# Altium project PCB_My_BOOST.PrjPcb
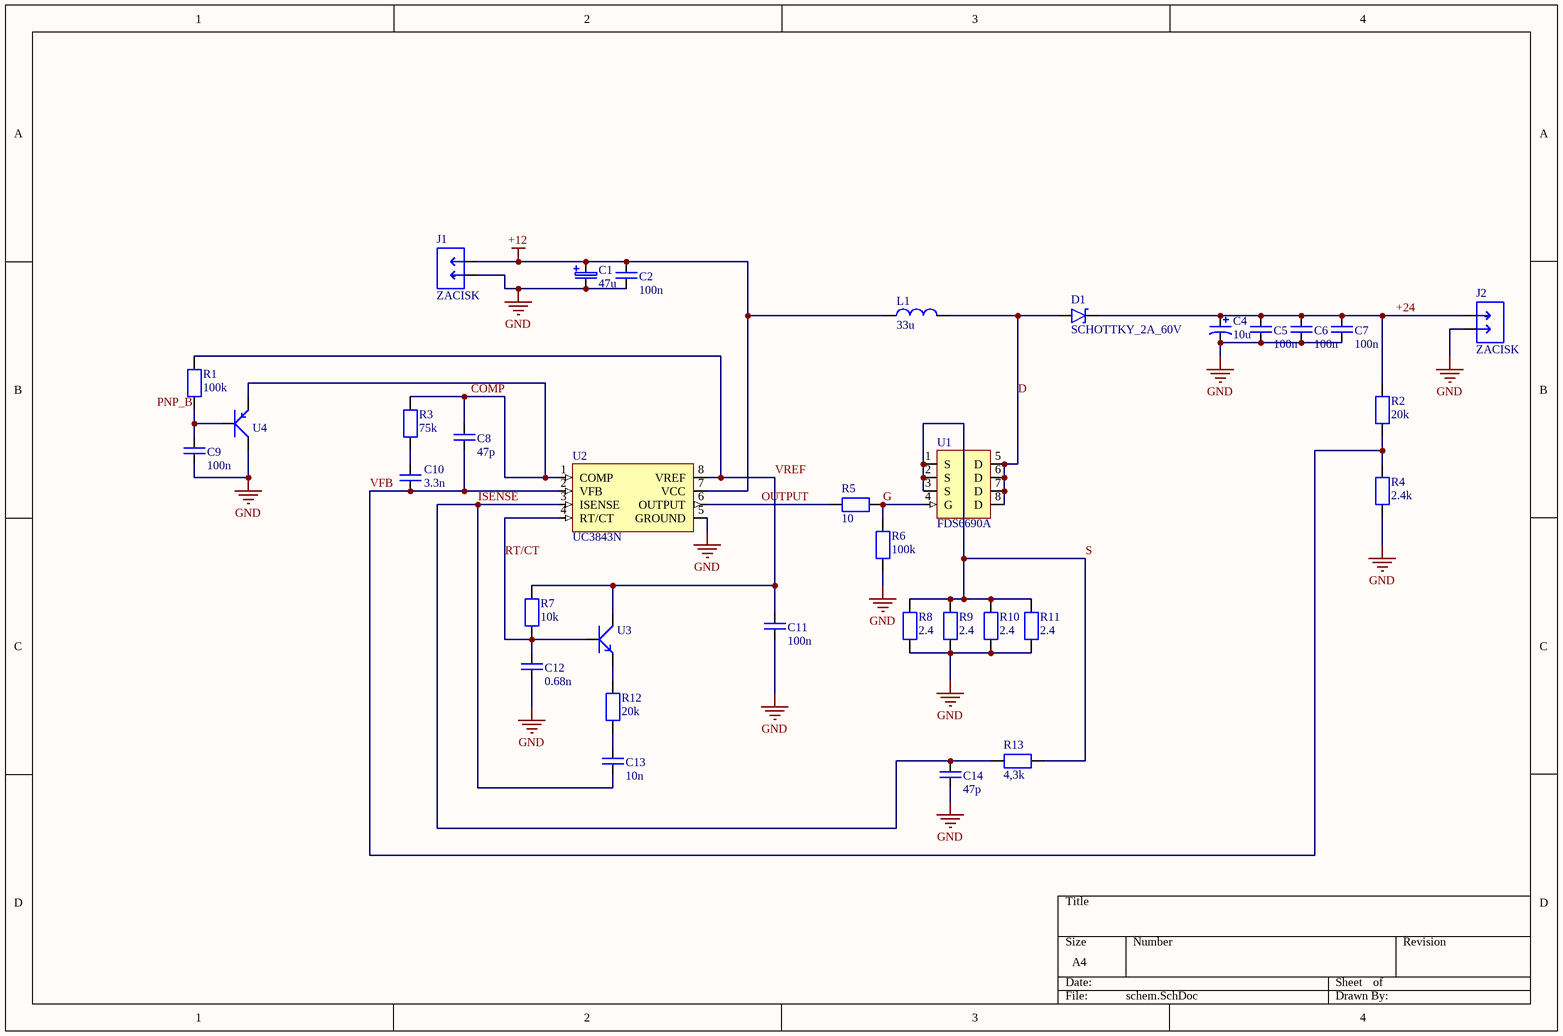
[diagram p0: schem.SchDoc]
1 sheet, 34 parts. Net scope: global (net labels, ports and power ports of the same name join across sheets).
Board files: PCB.PcbDoc, PCB_kopia.PcbDoc

## Sheet schem.SchDoc
size A4; SheetNumber: 1; SheetTotal: 1

### Parts
C1  47u  [CAP_ALUM]
C2  100n  [CAP_0805_CER]
C4  10u  [CAP_TANTAL_1210]
C5  100n  [CAP_0805_CER]
C6  100n  [CAP_0805_CER]
C7  100n  [CAP_0805_CER]
C8  47p  [CAP_0805_CER]
C9  100n  [CAP_0805_CER]
C10  3.3n  [CAP_0805_CER]
C11  100n  [CAP_0805_CER]
C12  0.68n  [CAP_0805_CER]
C13  10n  [CAP_0805_CER]
C14  47p  [CAP_0805_CER]
D1  SCHOTTKY_2A_60V  [23SCHOTTKY_60V_2A]
J1  ZACISK  [Zacisk]
J2  ZACISK  [Zacisk]
L1  33u  [DL50-33]
R1  100k  [RES_0805]
R2  20k  [RES_0805]
R3  75k  [RES_0805]
R4  2.4k  [RES_0805]
R5  10  [RES_0805]
R6  100k  [RES_0805]
R7  10k  [RES_0805]
R8  2.4  [RES_1206]
R9  2.4  [RES_1206]
R10  2.4  [RES_1206]
R11  2.4  [RES_1206]
R12  20k  [RES_0805]
R13  4,3k  [RES_0805]
U1  FDS6690A  [FDS6690A]
U2  UC3843N  [UC3843N]
U3  NPN_MMBT3904LT1G  [NPN]  (value not drawn)
U4  PNP_BC807-25LT1G  [PNP]  (value not drawn)

### Nets
+12: C1.2 C2.2 J1.1(+) L1.1 U2.7(VCC)
GND: C1.1 C2.1 C4.1 C5.1 C6.1 C7.1 C9.1 C11.1 C12.2 C14.1 J1.2(-) J2.1(+) R4.1 R6.1 R8.1 R9.1 R10.1 R11.1 U2.5(GROUND) U4.3
+24: C4.2 C5.2 C6.2 C7.2 D1.1 J2.2(-) R2.2
COMP: C8.2 R3.1 U2.1(COMP) U4.2
D: D1.2 L1.2 U1.5(D) U1.6(D) U1.7(D) U1.8(D)
G: R5.2 R6.2 U1.4(G)
ISENSE: C13.1 C14.2 R13.1 U2.3(ISENSE)
OUTPUT: R5.1 U2.6(OUTPUT)
PNP_B: C9.2 R1.1 U4.1
RT/CT: C12.1 R7.1 U2.4(RT/CT) U3.1
S: R8.2 R9.2 R10.2 R11.2 R13.2 U1.1(S) U1.2(S) U1.3(S)
VFB: C8.1 C10.2 R2.1 R4.2 U2.2(VFB)
VREF: C11.2 R1.2 R7.2 U2.8(VREF) U3.3
NetC10_1: C10.1 R3.2
NetC13_2: C13.2 R12.1
NetR12_2: R12.2 U3.2

### Library data of the parts
C1 = CAP_47uF_16V_ALUM: Kondensator: elektrolityczny; SMD; 47uF; 16VDC; Ø5x5,3mm; ±20%; Manufacturer Lifecycle Status: ACTIVE; Part Series: FK; Manufacturer: Panasonic; Value: 100µF; Dielectric Material: Aluminium; Dissipation Factor: 8%; ESR (Equivalent Series Resistance): 350mΩ; Leakage Current: 63µA; Life (Hours): 2000hours; Polarity: Polar; Ripple Current: 400mA; Voltage: 63V; Supplier: RS; Supplier Part Number: 7083623P; RoHS: Compliant; Stock: 1435; Case/Package: Radial; Contact Plating: Tin; Country of Origin: Japan, Malaysia; Diameter: 10mm; Export Control Classification Number (ECCN) Code: EAR99; Height: 10.2mm; Height - Seated (Max): 10.4902mm; Harmonized Tariff Schedule (HTS) Code: 8532.22.00.20; Impedance: 350mΩ; Introduction Date: 2004-08-25; Lead Free: Lead Free; Lifecycle Status: Production; Material: Aluminium; Max Operating Temperature: 105°C; Min Operating Temperature: -55°C; Mounting Technology: Surface Mount; Pins: 2; Number of Terminals: 2; Packaging: Cut Tape; Radiation Hardening: No; REACH SVHC: Yes; Ripple Current (AC): 400mA; Schedule B: 8532220020, 8532220020|8532220020|8532220020|8532220020|8532220020|8532220020|8532220020|8532220020|8532220020|8532220020|8532220020|8532220020|8532220020|8532220020|8532220020|8532220020|8532220020|8532220020|8532220020|8532220020|8532220020|8532220020|8532220020|85; Termination: SMD/SMT; Tolerance: 20%; Voltage Rating: 63V; Voltage Rating (AC): 63V; Voltage Rating (DC): 63V; Width: 10.3mm; ComponentLink1URL: https://datasheet.octopart.com:443/EEEFK1J101P-Panasonic-datasheet-62287436.pdf?src-supplier=Farnell; ComponentLink1Description: https://datasheet.octopart.com:443/EEEFK1J101P-Panasonic-datasheet-62287436.pdf?src-supplier=Farnell; ComponentLink2URL: https://datasheet.octopart.com:443/EEEFK1J101P-Panasonic-datasheet-5318435.pdf?src-supplier=Farnell; ComponentLink2Description: https://datasheet.octopart.com:443/EEEFK1J101P-Panasonic-datasheet-5318435.pdf?src-supplier=Farnell; ComponentLink3URL: https://datasheet.octopart.com:443/EEEFK1J101P-Panasonic-datasheet-5316599.pdf?src-supplier=Farnell; ComponentLink3Description: https://datasheet.octopart.com:443/EEEFK1J101P-Panasonic-datasheet-5316599.pdf?src-supplier=Farnell; ComponentLink4URL: https://datasheet.octopart.com:443/EEEFK1J101P-Panasonic-datasheet-5390910.pdf?src-supplier=Farnell; ComponentLink4Description: https://datasheet.octopart.com:443/EEEFK1J101P-Panasonic-datasheet-5390910.pdf?src-supplier=Farnell; ComponentLink5URL: https://datasheet.octopart.com:443/EEEFK1J101P-Panasonic-datasheet-7550061.pdf?src-supplier=Farnell; ComponentLink5Description: https://datasheet.octopart.com:443/EEEFK1J101P-Panasonic-datasheet-7550061.pdf?src-supplier=Farnell; ComponentLink6URL: https://datasheet.octopart.com:443/EEEFK1J101P-Panasonic-datasheet-1770.pdf?src-supplier=Farnell; ComponentLink6Description: https://datasheet.octopart.com:443/EEEFK1J101P-Panasonic-datasheet-1770.pdf?src-supplier=Farnell; ComponentLink7URL: https://datasheet.octopart.com:443/EEEFK1J101P-Panasonic-datasheet-1290.pdf?src-supplier=Farnell; ComponentLink7Description: https://datasheet.octopart.com:443/EEEFK1J101P-Panasonic-datasheet-1290.pdf?src-supplier=Farnell; ComponentLink8URL: https://datasheet.octopart.com:443/EEEFK1J101P-Panasonic-datasheet-2601.pdf?src-supplier=Farnell; ComponentLink8Description: https://datasheet.octopart.com:443/EEEFK1J101P-Panasonic-datasheet-2601.pdf?src-supplier=Farnell; ComponentLink9URL: https://datasheet.octopart.com:443/EEEFK1J101P-Panasonic-datasheet-122249.pdf?src-supplier=Farnell; ComponentLink9Description: https://datasheet.octopart.com:443/EEEFK1J101P-Panasonic-datasheet-122249.pdf?src-supplier=Farnell; ComponentLink10URL: https://datasheet.octopart.com:443/EEEFK1J101P-Panasonic-datasheet-4056.pdf?src-supplier=Farnell; ComponentLink10Description: https://datasheet.octopart.com:443/EEEFK1J101P-Panasonic-datasheet-4056.pdf?src-supplier=Farnell; ComponentLink11URL: https://datasheet.octopart.com:443/EEEFK1J101P-Panasonic-datasheet-169278531.pdf?src-supplier=IHS; ComponentLink11Description: https://datasheet.octopart.com:443/EEEFK1J101P-Panasonic-datasheet-169278531.pdf?src-supplier=IHS; ComponentLink12URL: https://datasheet.octopart.com:443/EEEFK1J101P-Panasonic-datasheet-8161.pdf?src-supplier=Newark; ComponentLink12Description: https://datasheet.octopart.com:443/EEEFK1J101P-Panasonic-datasheet-8161.pdf?src-supplier=Newark; ComponentLink13URL: https://datasheet.octopart.com:443/EEEFK1J101P-Panasonic-datasheet-61627622.pdf?src-supplier=Newark; ComponentLink13Description: https://datasheet.octopart.com:443/EEEFK1J101P-Panasonic-datasheet-61627622.pdf?src-supplier=Newark; ComponentLink14URL: https://datasheet.octopart.com:443/EEEFK1J101P-Panasonic-datasheet-8852369.pdf?src-supplier=Newark; ComponentLink14Description: https://datasheet.octopart.com:443/EEEFK1J101P-Panasonic-datasheet-8852369.pdf?src-supplier=Newark; ComponentLink15URL: https://datasheet.octopart.com:443/EEEFK1J101P-Panasonic-datasheet-8712906.pdf?src-supplier=Newark; ComponentLink15Description: https://datasheet.octopart.com:443/EEEFK1J101P-Panasonic-datasheet-8712906.pdf?src-supplier=Newark; ComponentLink16URL: https://datasheet.octopart.com:443/EEEFK1J101P-Panasonic-datasheet-13278598.pdf?src-supplier=Newark; ComponentLink16Description: https://datasheet.octopart.com:443/EEEFK1J101P-Panasonic-datasheet-13278598.pdf?src-supplier=Newark; ComponentLink17URL: https://datasheet.octopart.com:443/EEE-FK1J101P-Panasonic-datasheet-22087609.pdf?src-supplier=Newark; ComponentLink17Description: https://datasheet.octopart.com:443/EEE-FK1J101P-Panasonic-datasheet-22087609.pdf?src-supplier=Newark; ComponentLink18URL: https://datasheet.octopart.com:443/EEEFK1J101P-Panasonic-datasheet-11546739.pdf?src-supplier=Electro+Sonic; ComponentLink18Description: https://datasheet.octopart.com:443/EEEFK1J101P-Panasonic-datasheet-11546739.pdf?src-supplier=Electro+Sonic; ComponentLink19URL: https://datasheet.octopart.com:443/EEEFK1J101P-Panasonic-datasheet-13266987.pdf?src-supplier=RS+(Formerly+Allied+Electronics); ComponentLink19Description: https://datasheet.octopart.com:443/EEEFK1J101P-Panasonic-datasheet-13266987.pdf?src-supplier=RS+(Formerly+Allied+Electronics); ComponentLink20URL: https://datasheet.octopart.com:443/EEE-FK1J101P-Panasonic-datasheet-150469824.pdf?src-supplier=Master+Electronics; ComponentLink20Description: https://datasheet.octopart.com:443/EEE-FK1J101P-Panasonic-datasheet-150469824.pdf?src-supplier=Master+Electronics; ComponentLink21URL: https://datasheet.octopart.com:443/EEEFK1J101P-Panasonic-datasheet-8854493.pdf?src-supplier=Future+Electronics; ComponentLink21Description: https://datasheet.octopart.com:443/EEEFK1J101P-Panasonic-datasheet-8854493.pdf?src-supplier=Future+Electronics; ComponentLink22URL: https://datasheet.octopart.com:443/EEEFK1J101P-Panasonic-datasheet-8711795.pdf?src-supplier=Future+Electronics; ComponentLink22Description: https://datasheet.octopart.com:443/EEEFK1J101P-Panasonic-datasheet-8711795.pdf?src-supplier=Future+Electronics; ComponentLink23URL: https://datasheet.octopart.com:443/EEEFK1J101P-Panasonic-datasheet-5313801.pdf?src-supplier=Future+Electronics; ComponentLink23Description: https://datasheet.octopart.com:443/EEEFK1J101P-Panasonic-datasheet-5313801.pdf?src-supplier=Future+Electronics; ComponentLink24URL: https://datasheet.octopart.com:443/EEEFK1J101P-Panasonic-datasheet-7555708.pdf?src-supplier=Jameco; ComponentLink24Description: https://datasheet.octopart.com:443/EEEFK1J101P-Panasonic-datasheet-7555708.pdf?src-supplier=Jameco; ComponentLink25URL: https://sigma.octopart.com:443/150570760/technical_drawing/Panasonic-EEEFK1J101P.pdf?src-supplier=Panasonic+SCT; ComponentLink25Description: https://sigma.octopart.com:443/150570760/technical_drawing/Panasonic-EEEFK1J101P.pdf?src-supplier=Panasonic+SCT; ComponentLink26URL: https://datasheet.octopart.com:443/EEEFK1J101P-Panasonic-datasheet-136531309.pdf?src-supplier=TME; ComponentLink26Description: https://datasheet.octopart.com:443/EEEFK1J101P-Panasonic-datasheet-136531309.pdf?src-supplier=TME
C2 C5-C7 C9 C11 = CAP_100nF_ 0805_CER: Kondensator: ceramiczny; MLCC; 100nF; 50V; X7R; ±10%; SMD; 0805
C4 = CAP_10uF_1210_TANTALUM: Kondensator: tantalowo-polimerowy; low ESR; 10uF; 35VDC; B; 1210
C8 C14 = CAP_47pF_ 0805_CER: Kondensator: ceramiczny; MLCC; 47pF; 50V; C0G (NP0); ±5%; SMD; 0805
C10 = CAP_3,3nF_0805_CER: Kondensator: ceramiczny; MLCC; 3,3nF; 200V; C0G (NP0); ±5%; SMD
C12 = CAP_680pF_0805_CER: Kondensator: ceramiczny; MLCC; 680pF; 50V; C0G (NP0); ±5%; SMD; 0805
C13 = CAP_10nF_0805_CER: Kondensator: ceramiczny; MLCC; 10nF; 50V; C0G (NP0); ±5%; SMD; 0805
D1 = SCHOTTKY_2A_60V: Dioda: prostownicza Schottky; SMA; SMD; 60V; 2A; rolka,taśma; Manufacturer: STMicroelectronics; Manufacturer Part Number: STPS2L60A; Element Configuration: Single; Forward Voltage: 550mV; Max Forward Surge Current (Ifsm): 75A; Max Junction Temperature (Tj): 150°C; Max Reverse Leakage Current: 100µA; Number of Elements: 1; Polarity: Standard; Supplier: RS; Supplier Part Number: 249218P; RoHS: Compliant; Category: Schottky Diodes; Stock: 4660; Average Rectified Current: 2A; Case/Package: SMA; China RoHS: Non-Compliant; Contact Plating: Tin; Current Rating: 2A; Forward Current: 2A; Height: 2.65mm; Lead Free: Lead Free; Length: 4.6mm; Lifecycle Status: Production; Max Operating Temperature: 150°C; Max Output current: 2A; Max Repetitive Reverse Voltage (Vrrm): 60V; Max Reverse Voltage (DC): 60V; Max Surge Current: 75A; Min Operating Temperature: -65°C; Mounting Technology: Surface Mount; Pins: 2; Number of Terminals: 2; Output Current: 2A; Packaging: Tape and Reel; Peak Non-Repetitive Surge Current: 75A; Peak Reverse Current: 100µA; Radiation Hardening: No; REACH SVHC: No; Reverse Standoff Voltage: 60V; Schedule B: 8541100080, 8541100080|8541100080|8541100080|8541100080|8541100080, 8541100080|8541100080|8541100080|8541100080|8541100080|8541100080, 8541100080|8541100080|8541100080|8541100080|8541100080|8541100080|8541100080|8541100080|8541100080|8541100080|8541100080|8541100080|8541100080|8541100080|8541100080|8541100080|8541100080|8541100080|8541100080|8541100080|8541100080|8541100080|8541100080|85; Voltage Rating (DC): 60V; Weight: 4.535924g; Width: 2.95mm; ComponentLink1URL: https://datasheet.octopart.com:443/STPS2L60A-STMicroelectronics-datasheet-10540977.pdf?src-supplier=element14+APAC; ComponentLink1Description: https://datasheet.octopart.com:443/STPS2L60A-STMicroelectronics-datasheet-10540977.pdf?src-supplier=element14+APAC; ComponentLink2URL: https://datasheet.octopart.com:443/STPS2L60A-STMicroelectronics-datasheet-62337125.pdf?src-supplier=Newark; ComponentLink2Description: https://datasheet.octopart.com:443/STPS2L60A-STMicroelectronics-datasheet-62337125.pdf?src-supplier=Newark; ComponentLink3URL: https://datasheet.octopart.com:443/STPS2L60A-STMicroelectronics-datasheet-633754.pdf?src-supplier=element14; ComponentLink3Description: https://datasheet.octopart.com:443/STPS2L60A-STMicroelectronics-datasheet-633754.pdf?src-supplier=element14; ComponentLink4URL: https://datasheet.octopart.com:443/STPS2L60A-STMicroelectronics-datasheet-8474236.pdf?src-supplier=Farnell; ComponentLink4Description: https://datasheet.octopart.com:443/STPS2L60A-STMicroelectronics-datasheet-8474236.pdf?src-supplier=Farnell; ComponentLink5URL: https://datasheet.octopart.com:443/STPS2L60A-STMicroelectronics-datasheet-7700.pdf?src-supplier=DigiKey; ComponentLink5Description: https://datasheet.octopart.com:443/STPS2L60A-STMicroelectronics-datasheet-7700.pdf?src-supplier=DigiKey; ComponentLink6URL: https://datasheet.octopart.com:443/STPS2L60A-STMicroelectronics-datasheet-136784893.pdf?src-supplier=TME; ComponentLink6Description: https://datasheet.octopart.com:443/STPS2L60A-STMicroelectronics-datasheet-136784893.pdf?src-supplier=TME; ComponentLink7URL: https://datasheet.octopart.com:443/STPS2L60A-STMicroelectronics-datasheet-107242832.pdf?src-supplier=TME; ComponentLink7Description: https://datasheet.octopart.com:443/STPS2L60A-STMicroelectronics-datasheet-107242832.pdf?src-supplier=TME; ComponentLink8URL: https://datasheet.octopart.com:443/STPS2L60A-STMicroelectronics-datasheet-14054748.pdf?src-supplier=iiiC; ComponentLink8Description: https://datasheet.octopart.com:443/STPS2L60A-STMicroelectronics-datasheet-14054748.pdf?src-supplier=iiiC; ComponentLink9URL: https://datasheet.octopart.com:443/STPS2L60A-STMicroelectronics-datasheet-9806417.pdf?src-supplier=RS+(Formerly+Allied+Electronics); ComponentLink9Description: https://datasheet.octopart.com:443/STPS2L60A-STMicroelectronics-datasheet-9806417.pdf?src-supplier=RS+(Formerly+Allied+Electronics)
L1 = IND_33uH_3A: Dławik: drutowy; SMD; 33uH; Ipracy: 3A; R: 0,066Ω; Isat: 5,5A; Manufacturer: Eaton; Manufacturer Part Number: DRA127-330-R; Core Material: Ferrite; Current Rating: 3.22A; DC Resistance (DCR): 60mΩ; Value: 32.01µH; Inductance Tolerance: 20%; Number of Circuits: 1; Saturation Current: 6.22A; Self Resonant Frequency: 100kHz; Shielding: Yes; Supplier: DigiKey; Supplier Part Number: 283-3593-1-ND; RoHS: Compliant; Category: Fixed Inductors; Stock: 194; Pricing: 1=2,18, 10=1,796, 25=1,662, 50=1,5668, 100=1,4773 (USD); Case/Package: Nonstandard; Composition: Wirewound; Country of Origin: Philippines; Depth: 12.5mm; Export Control Classification Number (ECCN) Code: EAR99; Height: 8mm; Height - Seated (Max): 8.001mm; Harmonized Tariff Schedule (HTS) Code: 8504.50.80.00; Introduction Date: 2006-11-16; Lead Free: Lead Free; Lead Pitch: 7.5mm; Length: 12.5mm; Lifecycle Status: Production; Max Current Rating: 3.22A; Max DC Current: 3.22A; Max Operating Temperature: 165°C; Military Standard: Not; Min Operating Temperature: -40°C; Mounting Technology: Surface Mount; Pins: 2; Number of Terminals: 2; Packaging: Cut Tape; Radiation Hardening: No; Ratings: AEC-Q200; REACH SVHC: Yes; RMS Current (Irms): 3.22A; Schedule B: 8504500000, 8504500000|8504500000|8504500000|8504500000|8504500000|8504500000|8504500000|8504500000|8504500000|8504500000|8504500000|8504500000|8504500000|8504500000|8504500000|8504500000|8504500000|8504500000|8504500000|8504500000|8504500000|8504500000|8504500000|85; Termination: SMD/SMT; Test Frequency: 100kHz; Tolerance: 20%; Weight: 453.59237mg; Width: 12.5mm; ComponentLink1URL: https://datasheet.octopart.com:443/DRA127-330-R-Eaton-datasheet-137317803.pdf?src-supplier=Master+Electronics; ComponentLink1Description: https://datasheet.octopart.com:443/DRA127-330-R-Eaton-datasheet-137317803.pdf?src-supplier=Master+Electronics; ComponentLink2URL: https://datasheet.octopart.com:443/DRA127-330-R-Eaton-datasheet-613698.pdf?src-supplier=Master+Electronics; ComponentLink2Description: https://datasheet.octopart.com:443/DRA127-330-R-Eaton-datasheet-613698.pdf?src-supplier=Master+Electronics; ComponentLink3URL: https://datasheet.octopart.com:443/DRA127-330-R-Eaton-datasheet-62296927.pdf?src-supplier=Master+Electronics; ComponentLink3Description: https://datasheet.octopart.com:443/DRA127-330-R-Eaton-datasheet-62296927.pdf?src-supplier=Master+Electronics; ComponentLink4URL: https://datasheet.octopart.com:443/DRA127-330-R-Eaton-datasheet-137317933.pdf?src-supplier=Master+Electronics; ComponentLink4Description: https://datasheet.octopart.com:443/DRA127-330-R-Eaton-datasheet-137317933.pdf?src-supplier=Master+Electronics; ComponentLink5URL: https://datasheet.octopart.com:443/DRA127-330-R-Cooper-Industries-datasheet-12525441.pdf?src-supplier=Sager+Electronics; ComponentLink5Description: https://datasheet.octopart.com:443/DRA127-330-R-Cooper-Industries-datasheet-12525441.pdf?src-supplier=Sager+Electronics; ComponentLink6URL: https://datasheet.octopart.com:443/DRA127-330-R-Cooper-Bussmann-datasheet-180236337.pdf?src-supplier=IHS; ComponentLink6Description: https://datasheet.octopart.com:443/DRA127-330-R-Cooper-Bussmann-datasheet-180236337.pdf?src-supplier=IHS
R1 R6 = RES_100kΩ_0805: Rezystor: thick film; SMD; 0805; 100kΩ; 0,125W; ±1%; RC; 150V
R2 R12 = RES_20kΩ_0805: Rezystor: thick film; SMD; 0805; 20kΩ; 0,125W; ±1%; 150V; -55÷155°C
R3 = RES_75kΩ_0805: Rezystor: thick film; SMD; 0805; 75kΩ; 0,125W; ±1%; 150V; -55÷155°C
R4 = RES_2,4kΩ_0805: Rezystor: thick film; SMD; 0805; 2,4kΩ; 0,125W; ±5%; 150V; -55÷155°C
R5 = RES_10Ω_0805: Rezystor: thick film; SMD; 0805; 10Ω; 250mW; ±5%; 150V; -55÷125°C
R7 = RES_10kΩ_0805: Rezystor: thin film; precyzyjny; SMD; 0805; 10kΩ; 0,125W; ±0,1%
R8-R11 = RES_2,4Ω_1206: Rezystor: thick film; SMD; 1206; 2,4Ω; 0,25W; ±1%; 200V; -55÷155°C
R13 = RES_4,3kΩ_0805: Rezystor: thick film; SMD; 0805; 4,3kΩ; 0,125W; ±5%; 150V; -55÷155°C